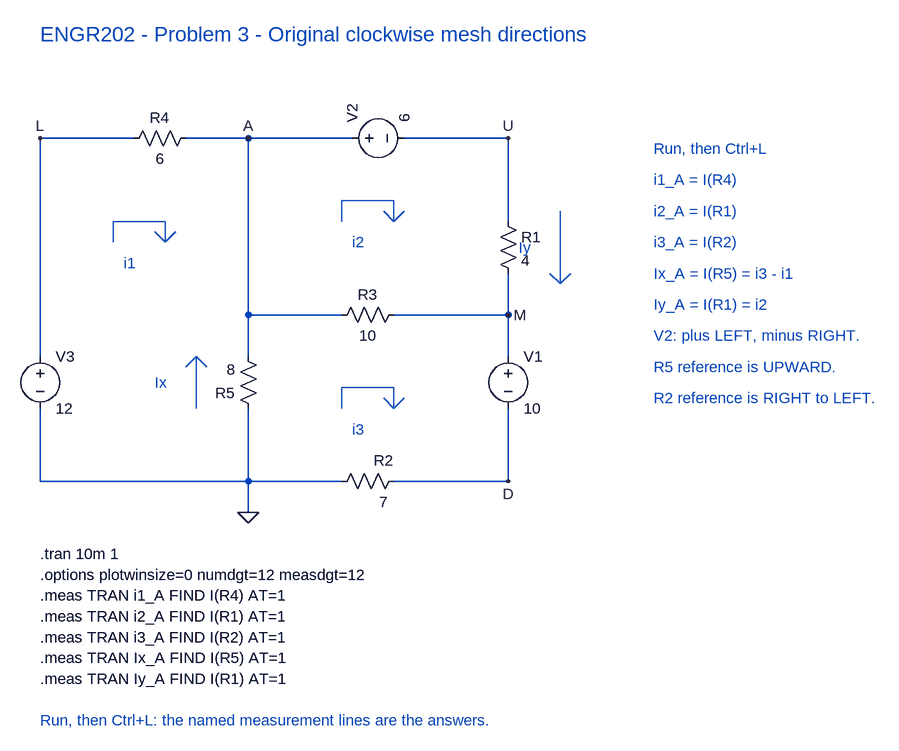
[diagram p0: schematic Problem3_Log.asc]
Problem3_Log.asc, the LTspice schematic file:
Version 4
SHEET 1 1640 1190
WIRE 80 128 224 128
WIRE 304 128 400 128
WIRE 400 128 560 128
WIRE 640 128 800 128
WIRE 800 128 800 256
WIRE 800 336 800 400
WIRE 800 400 800 464
WIRE 800 544 800 656
WIRE 800 656 624 656
WIRE 544 656 400 656
WIRE 400 656 80 656
WIRE 80 128 80 464
WIRE 80 544 80 656
WIRE 400 128 400 400
WIRE 400 400 400 464
WIRE 400 544 400 656
WIRE 400 656 400 704
WIRE 400 400 544 400
WIRE 624 400 800 400
FLAG 80 128 L
FLAG 400 128 A
FLAG 800 128 U
FLAG 800 400 M
FLAG 800 656 D
FLAG 400 704 0
SYMBOL res 208 144 R270
WINDOW 0 32 56 VTop 2
WINDOW 3 0 56 VBottom 2
SYMATTR InstName R4
SYMATTR Value 6
SYMBOL voltage 544 128 R270
SYMATTR InstName V2
SYMATTR Value 6
SYMBOL res 784 240 R0
SYMATTR InstName R1
SYMATTR Value 4
SYMBOL res 528 416 R270
WINDOW 0 32 56 VTop 2
WINDOW 3 0 56 VBottom 2
SYMATTR InstName R3
SYMATTR Value 10
SYMBOL res 416 560 R180
SYMATTR InstName R5
SYMATTR Value 8
SYMBOL res 640 640 R90
WINDOW 0 0 32 VBottom 2
WINDOW 3 32 32 VTop 2
SYMATTR InstName R2
SYMATTR Value 7
SYMBOL voltage 800 448 R0
SYMATTR InstName V1
SYMATTR Value 10
SYMBOL voltage 80 448 R0
SYMATTR InstName V3
SYMATTR Value 12
TEXT 80 -32 Left 3 ;ENGR202 - Problem 3 - Original clockwise mesh directions
LINE Normal 192 288 192 256
LINE Normal 192 256 272 256
LINE Normal 272 256 272 288
LINE Normal 272 288 256 272
LINE Normal 272 288 288 272
TEXT 208 320 Left 2 ;i1
LINE Normal 544 256 544 224
LINE Normal 544 224 624 224
LINE Normal 624 224 624 256
LINE Normal 624 256 608 240
LINE Normal 624 256 640 240
TEXT 560 288 Left 2 ;i2
LINE Normal 544 544 544 512
LINE Normal 544 512 624 512
LINE Normal 624 512 624 544
LINE Normal 624 544 608 528
LINE Normal 624 544 640 528
TEXT 560 576 Left 2 ;i3
LINE Normal 320 544 320 464
LINE Normal 320 464 304 480
LINE Normal 320 464 336 480
TEXT 256 504 Left 2 ;Ix
LINE Normal 880 240 880 352
LINE Normal 880 352 864 336
LINE Normal 880 352 896 336
TEXT 816 296 Left 2 ;Iy
TEXT 1024 144 Left 2 ;Run, then Ctrl+L
TEXT 1024 192 Left 2 ;i1_A = I(R4)
TEXT 1024 240 Left 2 ;i2_A = I(R1)
TEXT 1024 288 Left 2 ;i3_A = I(R2)
TEXT 1024 336 Left 2 ;Ix_A = I(R5) = i3 - i1
TEXT 1024 384 Left 2 ;Iy_A = I(R1) = i2
TEXT 1024 432 Left 2 ;V2: plus LEFT, minus RIGHT.
TEXT 1024 480 Left 2 ;R5 reference is UPWARD.
TEXT 1024 528 Left 2 ;R2 reference is RIGHT to LEFT.
TEXT 80 768 Left 2 !.tran 10m 1
TEXT 80 800 Left 2 !.options plotwinsize=0 numdgt=12 measdgt=12
TEXT 80 832 Left 2 !.meas TRAN i1_A FIND I(R4) AT=1
TEXT 80 864 Left 2 !.meas TRAN i2_A FIND I(R1) AT=1
TEXT 80 896 Left 2 !.meas TRAN i3_A FIND I(R2) AT=1
TEXT 80 928 Left 2 !.meas TRAN Ix_A FIND I(R5) AT=1
TEXT 80 960 Left 2 !.meas TRAN Iy_A FIND I(R1) AT=1
TEXT 80 1024 Left 2 ;Run, then Ctrl+L: the named measurement lines are the answers.

The netlist it stands for:
* Problem3_Log.asc
R4 L A 6
V2 A U 6
R1 U M 4
R3 A M 10
R5 0 A 8
R2 D 0 7
V1 M D 10
V3 L 0 12
* ENGR202 - Problem 3 - Original clockwise mesh directions
* i1
* i2
* i3
* Ix
* Iy
* Run, then Ctrl+L
* i1_A = I(R4)
* i2_A = I(R1)
* i3_A = I(R2)
* Ix_A = I(R5) = i3 - i1
* Iy_A = I(R1) = i2
* V2: plus LEFT, minus RIGHT.
* R5 reference is UPWARD.
* R2 reference is RIGHT to LEFT.
.tran 10m 1
.options plotwinsize=0 numdgt=12 measdgt=12
.meas TRAN i1_A FIND I(R4) AT=1
.meas TRAN i2_A FIND I(R1) AT=1
.meas TRAN i3_A FIND I(R2) AT=1
.meas TRAN Ix_A FIND I(R5) AT=1
.meas TRAN Iy_A FIND I(R1) AT=1
* Run, then Ctrl+L: the named measurement lines are the answers.
.backanno
.end